# Altium schematic sheet Top-Sheet.SchDoc
size A4; DocumentNumber: 1; SheetNumber: 1; SheetTotal: 10
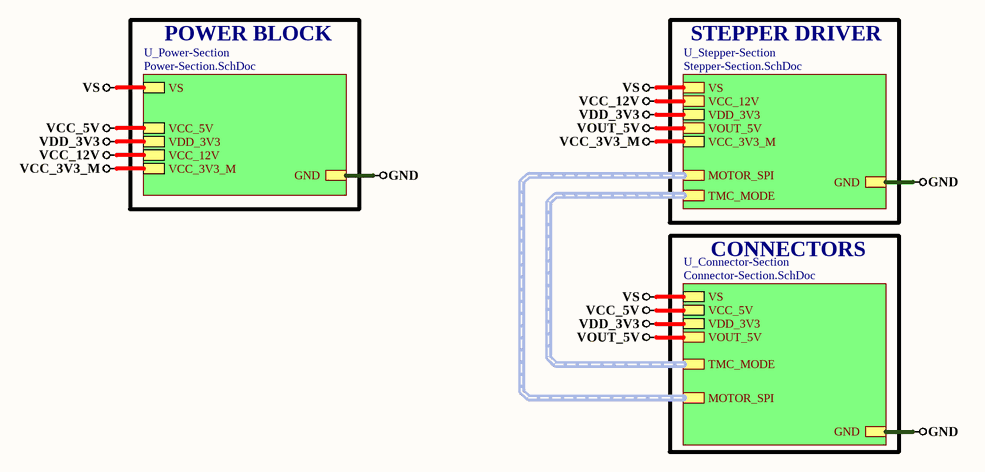
[diagram p0: Top-Sheet.SchDoc]

## Sub-sheets
U_Connector-Section = Connector-Section.SchDoc: VDD_3V3, GND, VCC_5V, VS, TMC_MODE (harness TMC_MODE), VOUT_5V, MOTOR_SPI (harness MOTOR_SPI)
U_Power-Section = Power-Section.SchDoc: VS, VCC_5V, VDD_3V3, VCC_3V3_M, VCC_12V, GND
U_Stepper-Section = Stepper-Section.SchDoc: VCC_3V3_M, VDD_3V3, GND, VCC_12V, VS, VOUT_5V, TMC_MODE (harness TMC_MODE), MOTOR_SPI (harness MOTOR_SPI)

## Nets
GND: sheet U_Power-Section/GND, sheet U_Stepper-Section/GND, sheet U_Connector-Section/GND
VCC_3V3_M: sheet U_Power-Section/VCC_3V3_M, sheet U_Stepper-Section/VCC_3V3_M
VCC_5V: sheet U_Power-Section/VCC_5V, sheet U_Connector-Section/VCC_5V
VCC_12V: sheet U_Power-Section/VCC_12V, sheet U_Stepper-Section/VCC_12V
VDD_3V3: sheet U_Power-Section/VDD_3V3, sheet U_Stepper-Section/VDD_3V3, sheet U_Connector-Section/VDD_3V3
VOUT_5V: sheet U_Stepper-Section/VOUT_5V, sheet U_Connector-Section/VOUT_5V
VS: sheet U_Power-Section/VS, sheet U_Stepper-Section/VS, sheet U_Connector-Section/VS

## Buses and harness runs
harness sheet U_Connector-Section/MOTOR_SPI = sheet U_Stepper-Section/MOTOR_SPI
harness sheet U_Connector-Section/TMC_MODE = sheet U_Stepper-Section/TMC_MODE

## Notes on the sheet
- POWER BLOCK
- STEPPER DRIVER
- CONNECTORS